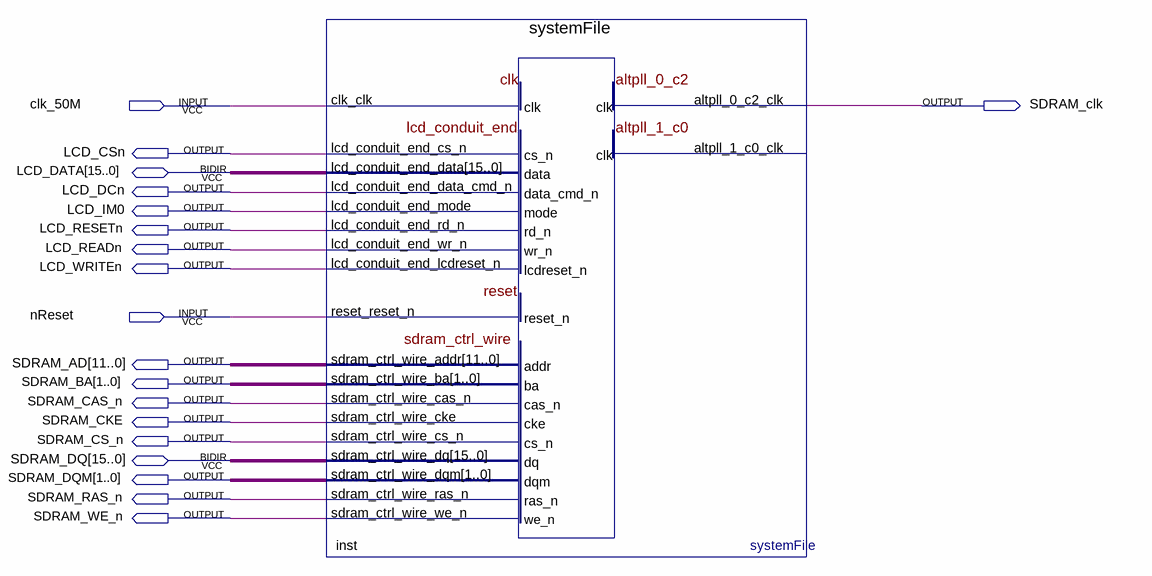
[diagram p0: schematic sheet]
// Quartus schematic topLevelEntity.bdf as structural Verilog: 1 symbols, 19 pins
module topLevelEntity (
  input  clk_50M,
  input  nReset,
  inout  [15:0] LCD_DATA,
  inout  [15:0] SDRAM_DQ,
  output SDRAM_clk,
  output LCD_CSn,
  output LCD_DCn,
  output LCD_IM0,
  output LCD_RESETn,
  output LCD_READn,
  output LCD_WRITEn,
  output [11:0] SDRAM_AD,
  output [1:0] SDRAM_BA,
  output SDRAM_CAS_n,
  output SDRAM_CKE,
  output SDRAM_CS_n,
  output [1:0] SDRAM_DQM,
  output SDRAM_RAS_n,
  output SDRAM_WE_n
);

  systemFile inst (
    .clk_clk(clk_50M), .reset_reset_n(nReset), .altpll_0_c2_clk(SDRAM_clk), .lcd_conduit_end_cs_n(LCD_CSn),
    .lcd_conduit_end_data_cmd_n(LCD_DCn), .lcd_conduit_end_mode(LCD_IM0), .lcd_conduit_end_rd_n(LCD_RESETn),
    .lcd_conduit_end_wr_n(LCD_READn), .lcd_conduit_end_lcdreset_n(LCD_WRITEn),
    .sdram_ctrl_wire_addr(SDRAM_AD), .sdram_ctrl_wire_ba(SDRAM_BA), .sdram_ctrl_wire_cas_n(SDRAM_CAS_n),
    .sdram_ctrl_wire_cke(SDRAM_CKE), .sdram_ctrl_wire_cs_n(SDRAM_CS_n), .sdram_ctrl_wire_dqm(SDRAM_DQM),
    .sdram_ctrl_wire_ras_n(SDRAM_RAS_n), .sdram_ctrl_wire_we_n(SDRAM_WE_n), .lcd_conduit_end_data(LCD_DATA),
    .sdram_ctrl_wire_dq(SDRAM_DQ));  // open: altpll_1_c0_clk
endmodule
